# EasyEDA Pro project ProPrj_MSP_M0_G3507_扩展板_2025-09-12.epro, board PCB1_1
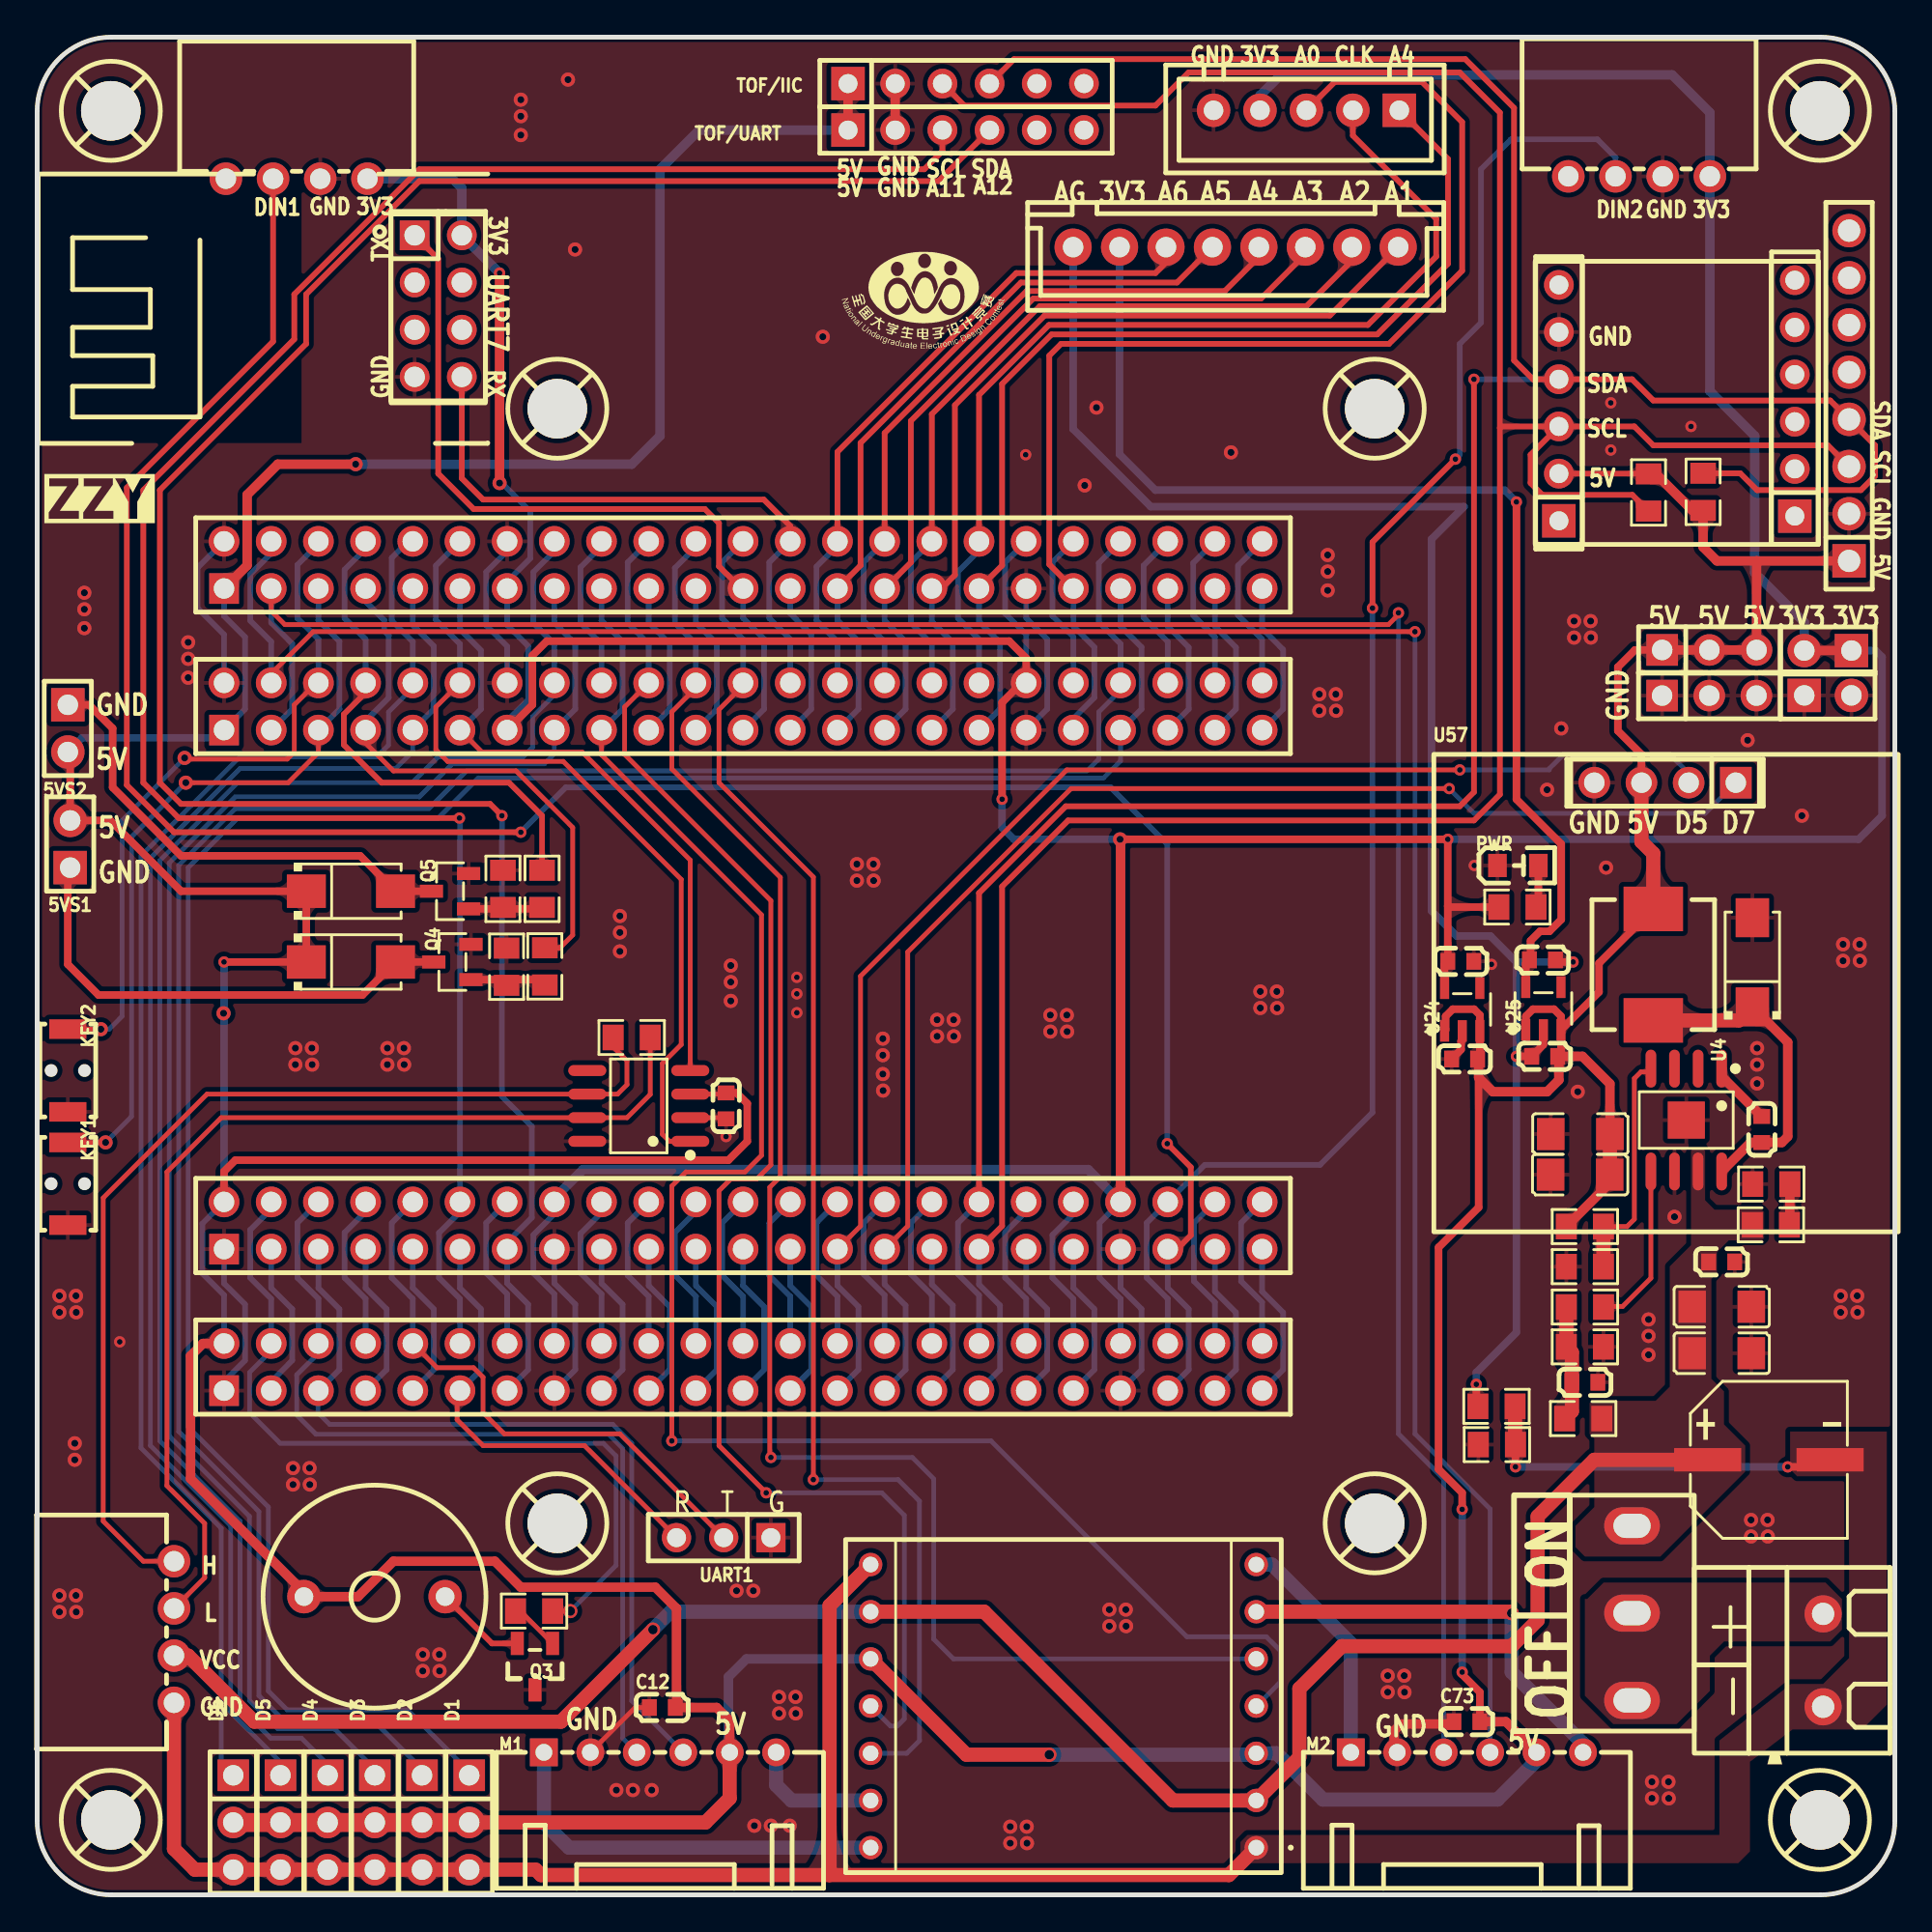
[diagram p2: board, top side]
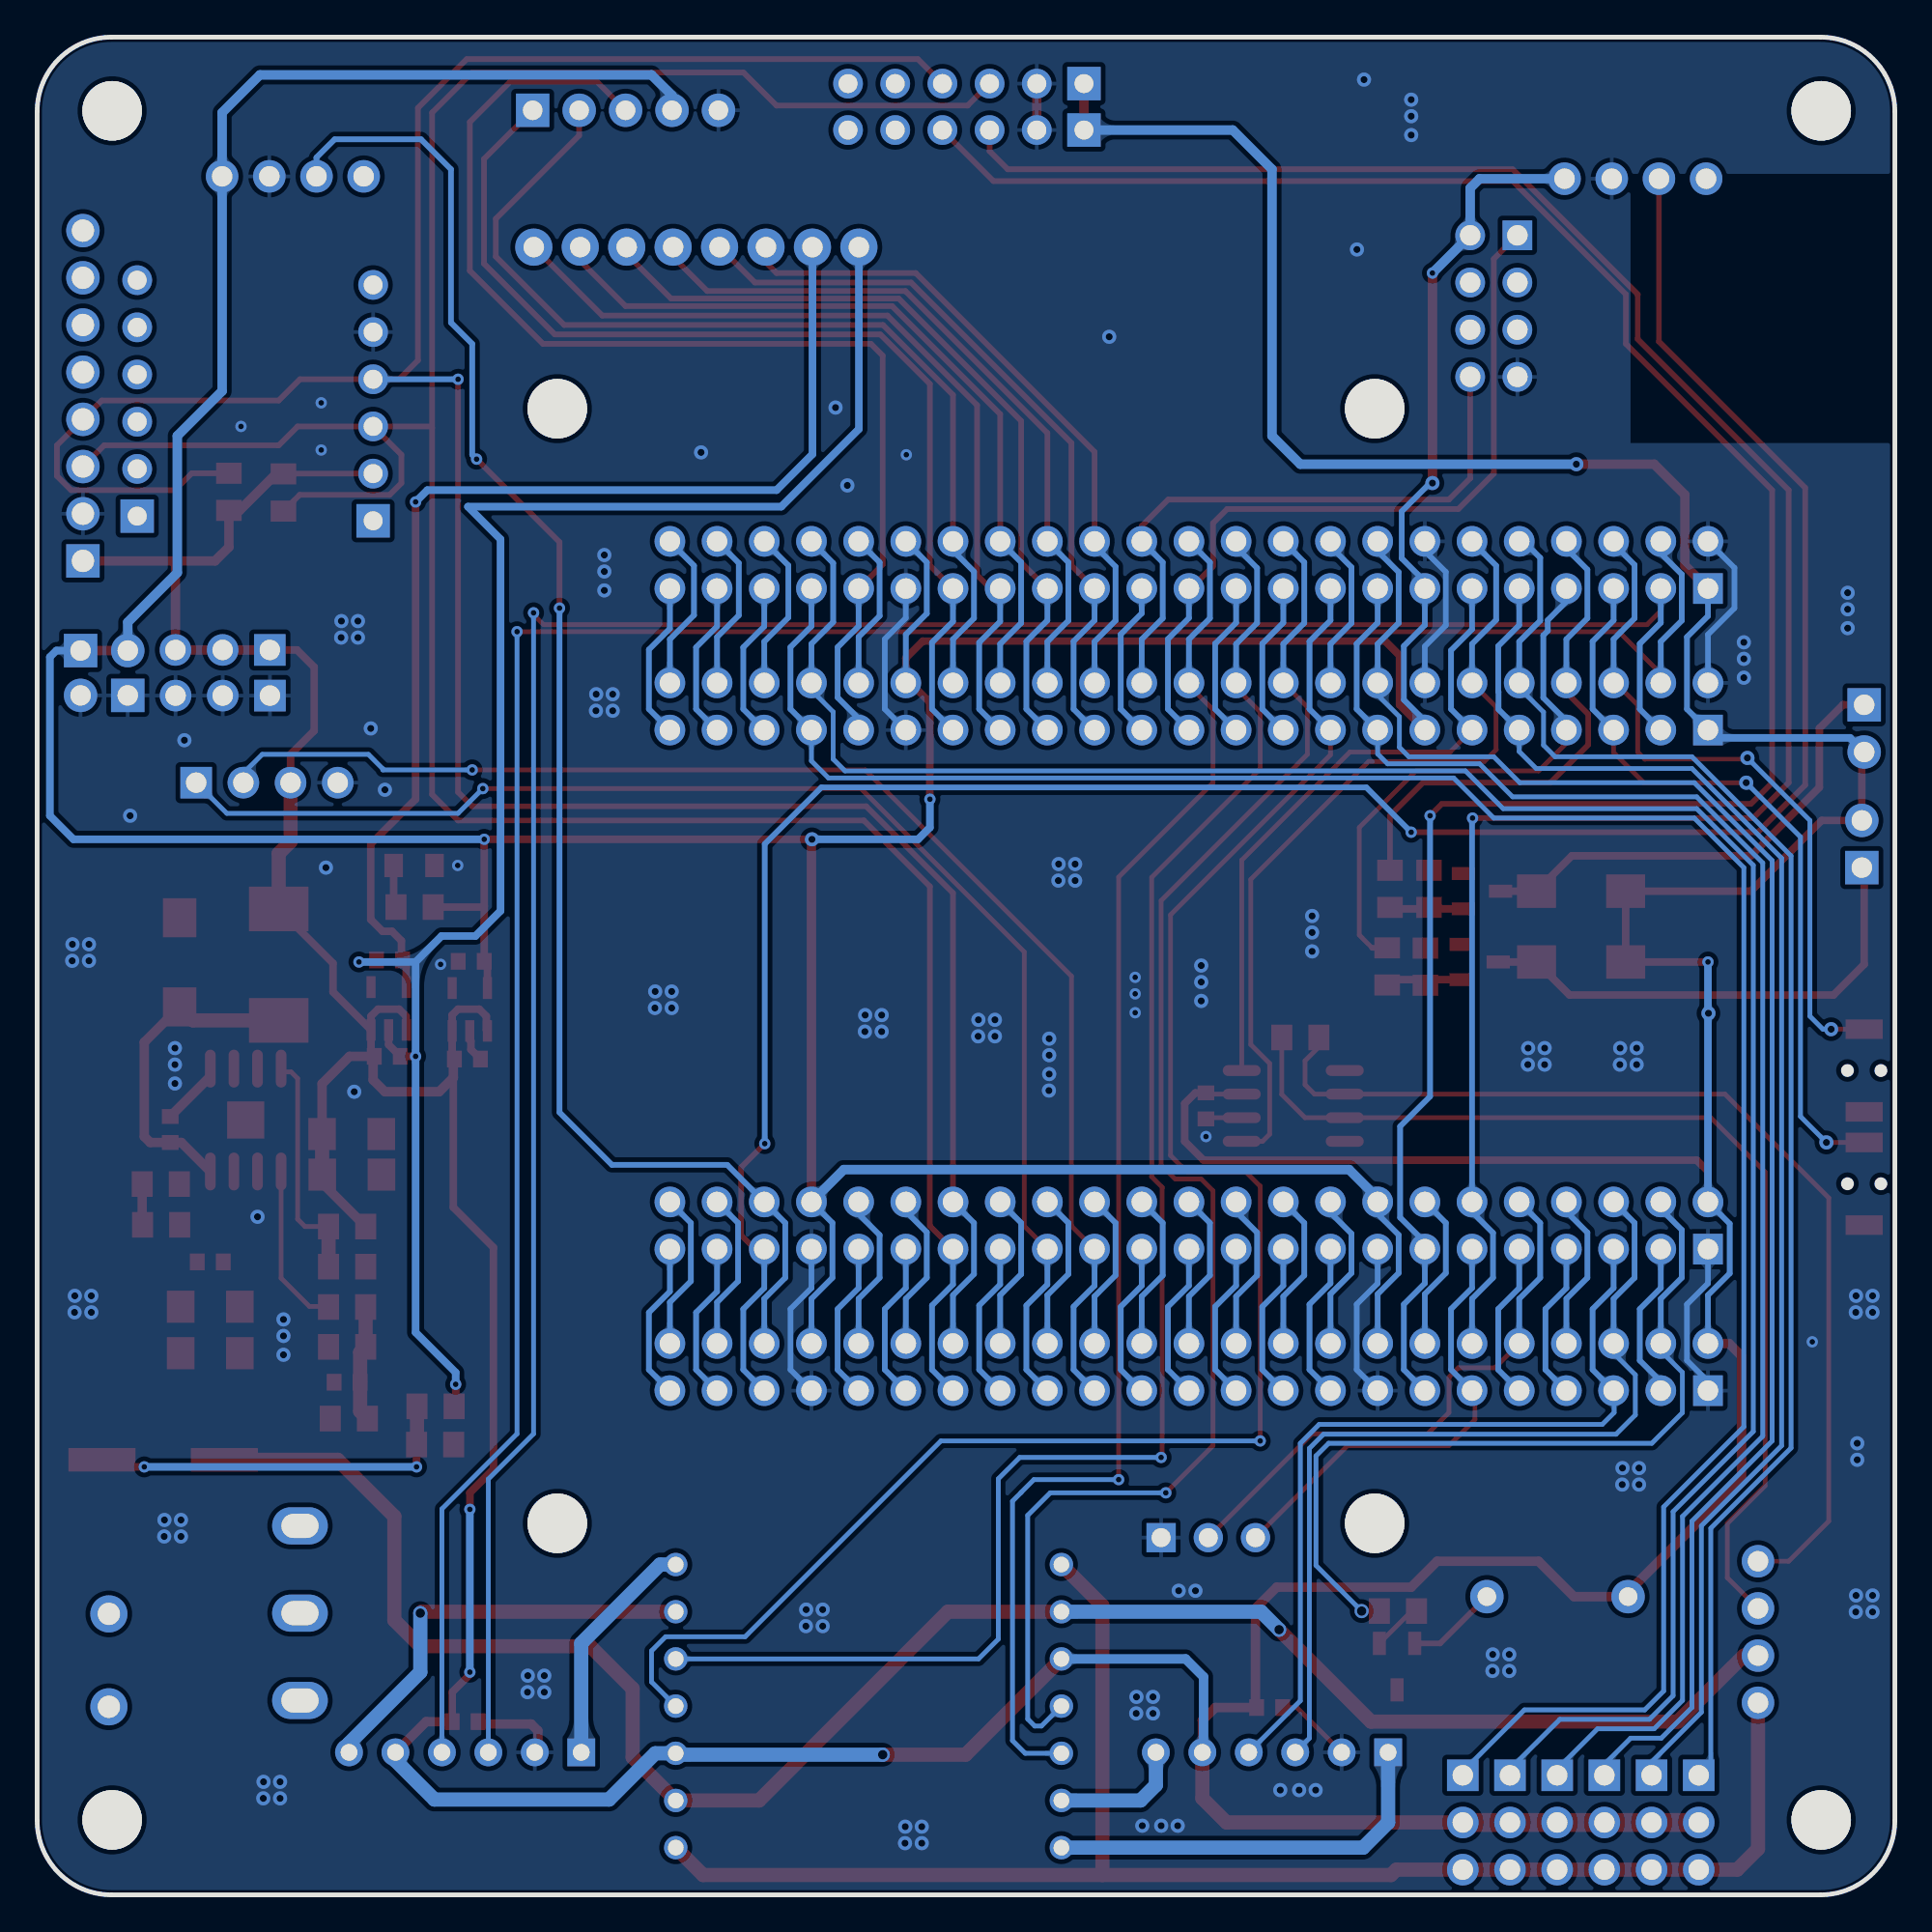
[diagram p3: board, bottom side, seen from below]

Outline 100 x 100 mm; copper layers: Top Layer, Bottom Layer. Coordinates in mm from the lower left corner of the outline.
Outline path: 0,96 0,4 arc(1.17,1.17) 4,0 96,0 arc(98.83,1.17) 100,4 100,96 arc(98.83,98.83) 96,100 4,100 arc(1.17,98.83) 0,96
Stack: Top Layer 0.035mm / Dielectric1 1.51mm FR4 er 4.5 / Bottom Layer 0.035mm

## Design rules (mm)
net CANL: DP1
net CANH: DP1
template: JLCPCB Capability(Two Layers Board)
spacing copperThickness1oz (default): track to track 0.102, other pairs 0.152 to 0.3
spacing copperThickness2oz: track to track 0.203, other pairs 0.152 to 0.3
track width copperThickness1oz (default): min 0.127, default 0.254, max 2.54
track width copperThickness2oz: min 0.203, default 0.254, max 2.54
differential pair differentialPair (default): width min 0.127, default 0.254, max 2.54; gap min 0.152, default 0.152
via viaSize (default): diameter min 0.5, default 0.61, max 10; hole min 0.3, default 0.305, max 6.3

## Placement (name value [footprint] x y rotation side)
5VS1  -  [HDR-TH_2P-P2.54-V-M-1]  1.78 56.57 90 top
5VS2  -  [HDR-TH_2P-P2.54-V-M-1]  1.65 62.79 270 top
BUZZER1  2.4kHz  [BUZ-TH_BD12.0-P7.60-D0.6-FD]  18.16 16.05 0 top
C3  220uF  [CAP-SMD_BD8.0-L8.3-W8.3-LS9.1-FD]  93.22 23.42 0 top
C4  4.7uF  [C0603]  90.68 34.07 0 top
C5  22uF  [C1206]  90.68 31.66 0 top
C6  47uF  [C1206]  90.68 29.16 0 top
C7  47uF  [C1206]  83.06 38.77 0 top
C8  22uF  [C1206]  83.07 40.95 0 top
C9  10nF  [C0603]  92.84 41.2 270 top
C12  100nF  [C0603]  33.66 10.08 0 top
C13  100NF  [C0603]  37.08 42.47 270 top
C32  100nF  [C0603]  83.31 27.59 180 top
C36  1uF  [C0603]  76.84 44.99 0 top
C37  1uF  [C0603]  76.63 50.25 180 top
C49  1uF  [C0603]  81.15 45.14 0 top
C50  1uF  [C0603]  81.03 50.33 180 top
C73  100nF  [C0603]  76.96 9.32 0 top
CN3  HWXJ  [CONN-TH_8P-P2.50-XH2.54-8P]  64.52 88.7 0 top
CN6  CAN  [CONN-TH_XH-4AW]  7.37 14.15 270 top
CN7  CCD  [CONN-TH_5P-P2.50_XH-5A]  68.33 96.06 180 top
CN9  L_DIN  [CONN-TH_XH-4AW]  13.97 92.38 180 top
CN10  R_DIN  [CONN-TH_XH-4AW]  86.23 92.51 180 top
D1  PZ254V-11-03P  [HDR-TH_3P-P2.54-V-M]  23.26 3.9 270 top
D2  PZ254V-11-03P  [HDR-TH_3P-P2.54-V-M]  20.72 3.9 270 top
D3  PZ254V-11-03P  [HDR-TH_3P-P2.54-V-M]  18.18 3.9 270 top
D4  PZ254V-11-03P  [HDR-TH_3P-P2.54-V-M]  15.64 3.9 270 top
D5  PZ254V-11-03P  [HDR-TH_3P-P2.54-V-M]  13.1 3.9 270 top
D6  PZ254V-11-03P  [HDR-TH_3P-P2.54-V-M]  10.56 3.9 270 top
ESP01S1  -  [HDR-TH_8P-P2.54-V-F-R2-C4-S2.54-1]  21.59 85.52 270 top
H6  -  [HDR-TH_6P-P2.54-V-F]  94.62 80.57 90 top
H20  -  [HDR-TH_8P-P2.54-V-F-1]  97.54 80.7 90 top
H21  -  [HDR-TH_3P-P2.54-V-M]  90.01 67.01 0 top
H22  -  [HDR-TH_2P-P2.54-V-M-1]  96.39 66.98 180 top
H24  -  [HDR-TH_2P-P2.54-V-M-1]  96.39 64.57 0 top
H25  -  [HDR-TH_3P-P2.54-V-M]  90.01 64.56 0 top
H26  -  [HDR-TH_4P-P2.54-V-F]  87.63 59.87 180 top
JY901I2C1  -  [HDR-TH_6P-P2.54-V-F]  81.91 80.31 90 top
KEY1  ZX-QC34-2TPDZ  [KEY-SMD_L3.9-W3.0-LS5.0-EH]  1.65 38.28 270 top
KEY2  ZX-QC34-2TPDZ  [KEY-SMD_L3.9-W3.0-LS5.0-EH]  1.65 44.37 270 top
M1  ZX-HA2.54-6PWZ  [CONN-TH_6P-P2.50_ZX-HA2.54-6PWZ-Y]  33.53 7.67 0 top
M2  ZX-HA2.54-6PWZ  [CONN-TH_6P-P2.50_ZX-HA2.54-6PWZ-Y]  76.96 7.67 0 top
P1  KF301-2P接线端子  [CONN-TH_XY301V-A-5.0-2P]  96.14 12.62 270 top
PWR  -  [LED_0805]  79.76 55.41 0 top
Q3  -  [S8550P_SOT]  26.8 12.24 90 top
Q4  AO3400A  [SOT-23-3_L2.9-W1.3-P1.90-LS2.4-BR]  22.35 50.22 0 top
Q5  AO3400A  [SOT-23-3_L2.9-W1.3-P1.90-LS2.4-BR]  22.22 54.03 0 top
R1  10K  [R0805]  93.33 36.07 0 top
R5  1K  [R0805]  93.35 38.26 0 top
R6  10K  [R0805]  83.31 35.97 180 top
R7  3.3K  [R0805]  83.31 33.82 0 top
R8  120R  [R0805]  32 46.15 0 top
R16  6.8KNTC  [R0805]  83.31 29.5 180 top
R17  10K  [R0805]  83.22 25.64 0 top
R18  0R  [R0805]  83.32 31.64 0 top
R19  0R  [R0805]  78.58 24.24 0 top
R20  3.3K  [R0805]  86.74 75.49 90 top
R21  3.3K  [R0805]  89.68 75.52 270 top
R23  1K  [R0805]  26.75 15.28 180 top
R24  6.8K  [R0805]  79.68 53.17 180 top
R89  0R  [R0805]  78.56 26.3 0 top
R90  22R  [R0805]  27.33 49.98 90 top
R91  10K  [R0805]  25.27 49.96 90 top
R92  22R  [R0805]  27.18 54.15 90 top
R93  10K  [R0805]  25.07 54.15 90 top
SCREW1  -  [M3螺丝]  3.97 4.03 270 top
SCREW2  -  [M3螺丝]  95.97 96.03 270 top
SCREW3  -  [M3螺丝]  3.97 96.03 270 top
SCREW4  -  [M3螺丝]  95.97 4.03 270 top
SCREW5  -  [M3螺丝]  72 20 0 top
SCREW6  -  [M3螺丝]  72 80 0 top
SCREW7  -  [M3螺丝]  28 80 0 top
SCREW8  -  [M3螺丝]  28 20 0 top
SW1  SS-12D10L5  [SW-TH_SS-12D10L5]  85.85 15.16 90 top
TOF/IIC  -  [HDR-TH_6P-P2.54-V-F]  50 97.5 0 top
TOF/UART  -  [HDR-TH_6P-P2.54-V-F]  50 95 0 top
U4  RT8289GSP  [SOIC-8_L5.0-W4.0-P1.27-LS6.0-BL-EP2.0]  88.77 41.71 180 top
U5  TJA1050T  [SOIC-8_L4.9-W3.9-P1.27-LS6.0-BL]  32.38 42.47 90 top
U24  RT9013-33GB  [SOT-23-5_L3.0-W1.7-P0.95-LS2.8-BL]  76.71 47.66 0 top
U25  RT9013-33GB  [SOT-23-5_L3.0-W1.7-P0.95-LS2.8-BL]  81.08 47.71 0 top
U41  AT8236  [AT8236-Dual-Module]  55.25 10.21 180 top
U48  -  [jy901]  95.88 72.57 180 top
U50  -  [esp01s]  24.26 92.63 270 top
U51  10uH  [IND-SMD_L7.0-W6.6]  87 50.07 270 top
U52  SS54  [SMA_L4.2-W2.6-LS5.1-RD]  16.89 50.22 0 top
U53  SS54  [SMA_L4.2-W2.6-LS5.1-RD]  92.33 50.2 90 top
U54  SS54  [SMA_L4.2-W2.6-LS5.1-RD]  16.89 54.03 0 top
U55  HC-PM254-8.5H-2x23PZ  [HDR-TH_46P-P2.54-V-F-R2-C23-S2.54]  38 36.03 0 top
U56  HC-PM254-8.5H-2x23PZ  [HDR-TH_46P-P2.54-V-F-R2-C23-S2.54]  38 63.97 0 top
U57  -  [OLED_9.6]  75.18 61.39 0 top
U58  HC-PM254-8.5H-2x23PZ  [HDR-TH_46P-P2.54-V-F-R2-C23-S2.54]  38 28.41 0 top
U59  HC-PM254-8.5H-2x23PZ  [HDR-TH_46P-P2.54-V-F-R2-C23-S2.54]  38 71.59 0 top
UART1  -  [HDR-TH_3P-P2.54-V-F]  36.96 19.23 180 top

## Footprints (pads in the part's own frame, mm; a bottom-side part is the same pattern mirrored in y, then rotated)
AT8236-Dual-Module
  round 1.26 hole 0.84: 1(-10.38,7.671) 2(-10.38,5.131) 3(-10.38,2.591) 4(-10.38,0.051) 5(-10.38,-2.489) 6(-10.38,-5.029) 7(-10.38,-7.569) 8(10.38,7.671) 9(10.38,5.131) 10(10.38,2.591) 11(10.38,0.051) 12(10.38,-2.489) 13(10.38,-5.029) 14(10.38,-7.569)
BUZ-TH_BD12.0-P7.60-D0.6-FD
  round 1.8 hole 1: 1(-3.8,0) 2(3.8,0)
C0603
  rect 0.8x0.9 smd: 1(-0.7,0) 2(0.7,0)
C1206
  rect 1.485x1.728 smd: 1(-1.593,0) 2(1.593,0)
CAP-SMD_BD8.0-L8.3-W8.3-LS9.1-FD
  rect 3.61x1.26 smd: 1(-3.295,0) 2(3.295,0)
CONN-TH_5P-P2.50_XH-5A
  rect 1.8x1.8 hole 1.05: 1(-5,0)
  round 1.8 hole 1.05: 2(-2.498,0) 3(0.002,0) 4(2.501,0) 5(5,0)
CONN-TH_6P-P2.50_ZX-HA2.54-6PWZ-Y
  rect 1.5x1.5 hole 0.9: 1(-6.25,0)
  round 1.5 hole 0.9: 2(-3.75,0) 3(-1.25,0) 4(1.25,0) 5(3.75,0) 6(6.25,0)
CONN-TH_8P-P2.50-XH2.54-8P
  round 2 hole 1.1: 1(8.75,0) 2(6.25,0) 3(3.75,0) 4(1.25,0) 5(-1.25,0) 6(-3.75,0) 7(-6.25,0) 8(-8.75,0)
CONN-TH_XH-4AW
  round 1.75 hole 1.1: 1(-3.81,0) 2(-1.27,0) 3(1.27,0) 4(3.81,0)
CONN-TH_XY301V-A-5.0-2P
  round 2 hole 1.2: 1(-2.5,0) 2(2.5,0)
HDR-TH_2P-P2.54-V-M-1
  rect 1.8x1.8 hole 1.1: 1(-1.27,0)
  round 1.8 hole 1.1: 2(1.27,0)
HDR-TH_3P-P2.54-V-F
  rect 1.575x1.575 hole 1.02: 1(-2.54,0)
  round 1.575 hole 1.02: 2(0,0) 3(2.54,0)
HDR-TH_3P-P2.54-V-M
  rect 1.7x1.7 hole 1.1: 1(-2.54,0)
  round 1.7 hole 1.1: 2(0,0) 3(2.54,0)
HDR-TH_4P-P2.54-V-F
  rect 1.7x1.7 hole 1.1: 1(-3.81,0)
  round 1.7 hole 1.1: 2(-1.27,0) 3(1.27,0) 4(3.81,0)
HDR-TH_6P-P2.54-V-F
  rect 1.8x1.8 hole 1.02: 1(-6.35,0)
  round 1.6 hole 1.02: 2(-3.81,0) 3(-1.27,0) 4(1.27,0) 5(3.81,0) 6(6.35,0)
HDR-TH_8P-P2.54-V-F-1
  rect 1.8x1.8 hole 1.2: 1(-8.89,0)
  round 1.8 hole 1.2: 2(-6.35,0) 3(-3.81,0) 4(-1.27,0) 5(1.27,0) 6(3.81,0) 7(6.35,0) 8(8.89,0)
HDR-TH_8P-P2.54-V-F-R2-C4-S2.54-1
  rect 1.6x1.6 hole 1.1: 1(-3.81,-1.27)
  round 1.6 hole 1.1: 2(-3.81,1.27) 3(-1.27,-1.27) 4(-1.27,1.27) 5(1.27,-1.27) 6(1.27,1.27) 7(3.81,-1.27) 8(3.81,1.27)
HDR-TH_46P-P2.54-V-F-R2-C23-S2.54
  rect 1.6x1.65 hole 1.1: 1(-27.94,-1.27)
  round 1.65 hole 1.1: 2(-27.94,1.27) 3(-25.4,-1.27) 4(-25.4,1.27) 5(-22.86,-1.27) 6(-22.86,1.27) 7(-20.32,-1.27) 8(-20.32,1.27) 9(-17.78,-1.27) 10(-17.78,1.27) 11(-15.24,-1.27) 12(-15.24,1.27) 13(-12.7,-1.27) 14(-12.7,1.27) 15(-10.16,-1.27) 16(-10.16,1.27) 17(-7.62,-1.27) 18(-7.62,1.27) 19(-5.08,-1.27) 20(-5.08,1.27) 21(-2.54,-1.27) 22(-2.54,1.27) 23(0,-1.27) 24(0,1.27) 25(2.54,-1.27) 26(2.54,1.27) 27(5.08,-1.27) 28(5.08,1.27) 29(7.62,-1.27) 30(7.62,1.27) 31(10.16,-1.27) 32(10.16,1.27) 33(12.7,-1.27) 34(12.7,1.27) 35(15.24,-1.27) 36(15.24,1.27) 37(17.78,-1.27) 38(17.78,1.27) 39(20.32,-1.27) 40(20.32,1.27) 41(22.86,-1.27) 42(22.86,1.27) 43(25.4,-1.27) 44(25.4,1.27) 45(27.94,-1.27) 46(27.94,1.27)
IND-SMD_L7.0-W6.6
  rect 2.4x3.2 smd: 1(-3,0) 2(3,0)
KEY-SMD_L3.9-W3.0-LS5.0-EH
  rect 1.05x2 smd: 1(-2.225,0) 2(2.225,0)
LED_0805
  rect 1x1.25 smd: 1(-1.15,0.005) 2(1.05,0.005)
M3螺丝
  round 3.2 hole 3.2: 1(0,0)
R0805
  rect 1.133x1.377 smd: 1(-1,0) 2(1,0)
S8550P_SOT
  rect 1.25x0.701 smd: 1(1.292,-0.95) 2(1.292,0.95) 3(-1.208,0)
SMA_L4.2-W2.6-LS5.1-RD
  rect 2.1x1.8 smd: 1(-2.4,0) 2(2.4,0)
SOIC-8_L4.9-W3.9-P1.27-LS6.0-BL
  oval 0.588x2.045 smd: 1(-1.905,-2.772) 2(-0.635,-2.772) 3(0.635,-2.772) 4(1.905,-2.772) 5(1.905,2.772) 6(0.635,2.772) 7(-0.635,2.772) 8(-1.905,2.772)
SOIC-8_L5.0-W4.0-P1.27-LS6.0-BL-EP2.0
  oval 0.574x2.038 smd: 1(-1.905,-2.769) 2(-0.635,-2.769) 3(0.635,-2.769) 4(1.905,-2.769) 5(1.905,2.769) 6(0.635,2.769) 7(-0.635,2.769) 8(-1.905,2.769)
  rect 2x2 smd: 9(0,0)
SOT-23-3_L2.9-W1.3-P1.90-LS2.4-BR
  rect 1.25x0.7 smd: 1(1,-0.95) 2(1,0.95) 3(-1,0)
SOT-23-5_L3.0-W1.7-P0.95-LS2.8-BL
  rect 0.49x1.157 smd: 1(-0.95,-1.153) 2(0,-1.153) 3(0.95,-1.153)
  rect 0.49x1.175 smd: 4(0.95,1.153) 5(-0.95,1.153)
SW-TH_SS-12D10L5
  oval 2x3 hole 1.3x2: 1(-4.7,0) 2(0,0) 3(4.7,0)

## Nets
As in the schematic, except:
GND: C4.2 C5.2 C6.2 C7.1 C8.1 C12.1 C13.2 C32.1 C36.1 C37.1 C73.1 CN7.5 CN9.2 CN10.2 ESP01S1.7 H20.2 H24.1 H24.2 H25.1 H25.2 H25.3 H26.4 JY901I2C1.5 KEY1.2 KEY2.2 M1.2 M2.2 PWR.1 Q3.3 Q4.2 Q5.2 R5.1 R7.1 R16.1 R19.1 R91.2 R93.2 TOF/IIC.2 TOF/UART.2 U4.6 U4.9 U5.2 U5.8 U24.2 U53.2 U55.1 U55.15 U55.39 U56.2 U56.14 U56.35 U58.1 U58.15 U58.39 U59.2 U59.14 U59.35 UART1.1
PA9: U55.10 U58.10 UART1.2
PA10: U55.11 U58.11 UART1.3

Pads without a net: CN9 4; CN10 4; ESP01S1 3 4 5 6; H6 1 2 3 4 5 6; H20 5 6 7 8; JY901I2C1 1 6; SCREW1 1; SCREW2 1; SCREW3 1; SCREW4 1; SCREW5 1; SCREW6 1; SCREW7 1; SCREW8 1; TOF/IIC 5 6; TOF/UART 5 6; U4 2 3; U5 5; U24 4; U25 4

## Via types
v1: diameter 0.762, hole 0.381, Top Layer to Bottom Layer, 139 vias
v2: diameter 0.61, hole 0.305, Top Layer to Bottom Layer, 38 vias
v3: diameter 0.762, hole 0.508, Top Layer to Bottom Layer, 4 vias

## Routing (per net, layer and track width the routed paths; a pad name or vN(x,y) marks a point on that pad's centre or on a via; arc(x,y) is an arc through that point)
3V3: length 286
  Top Layer w0.406: v2(51.94,58.98) 51.94,64.19 53,65.24 U56.36 53.24,66.57 52.32,67.49 27.43,67.49 26.66,66.72 26.66,64.06 U56.13 ; 75.94,53.22 C37.2 75.76,50.08 75.76,48.81 ; 75.94,53.22 v2(75.94,56.82) 58.25,56.82 ; 75.94,53.22 75.99,53.17 R24.2
  Top Layer w0.508: v2(24.89,87.3) v1(24.89,76) ; U55.40 58.32,56.75 58.25,56.82 ; H22.2 H22.1
  Bottom Layer w0.305: U59.36 52.11,71.73 52.11,68.97 53.24,67.84 53.24,64.95 ; U55.40 57.19,36.17 57.19,33.22 58.32,32.09 U58.40 ; U56.13 25.3,63.2 26.43,64.33 26.43,67.22 25.3,68.35 U59.13 25.3,70.7 26.54,71.94 26.54,74.47 25.02,76 v1(24.89,76) ; U58.16 27.84,32.34 26.71,33.47 26.71,35.52 27.84,36.65 U55.16
  Bottom Layer w0.406: v2(51.94,58.98) 51.94,57.45 52.58,56.82 v1(58.29,56.82) ; H22.1 98.97,66.98 99.31,66.63 99.31,58.09 98.04,56.82 v2(75.94,56.82)
  Bottom Layer w0.508: H22.2 95.12,68.5 92.46,71.17 92.46,78.54 90.04,80.95 CN10.1 90.04,95.94 88.01,97.97 66.93,97.97 65.83,96.86 CN7.4 ; U55.40 56.58,39.04 29.38,39.04 27.84,37.5 U55.16 ; v2(24.89,87.3) ESP01S1.2 22.86,91.87 22.35,92.38 CN9.1
5V_SW1: length 30
  Top Layer w0.254: U56.7 17.68,62 19.18,60.5 25.78,60.5 28.83,57.45 28.83,51.67 28.14,50.98
  Top Layer w0.305: R90.2 28.14,50.98
  Bottom Layer w0.305: U56.7 17.68,63.2 18.92,64.44 18.92,67.8 18.68,68.04 18.68,68.62 17.68,69.62 U59.7
5V_SW2: length 27.9
  Top Layer w0.305: R92.2 27.18,58.09 25.4,59.87 18.55,59.87 16.51,61.91 16.51,63.55 17.68,64.72 U56.8
  Bottom Layer w0.305: U59.8 17.68,72.47 16.55,71.34 16.55,68.72 17.68,67.59 17.68,64.95
+5V: length 413.9
  Top Layer w0.254: C13.1 37.02,43.1 U5.3
  Top Layer w0.305: R20.2 86.72,76.5 JY901I2C1.2
  Top Layer w0.406: 77.6,43.99 77.6,37.01 75.44,34.85 75.44,22.91 76.71,21.64 v2(76.71,20.75) ; C36.2 77.66,45.12 U24.3 77.66,47.36 77.35,47.68 76.2,47.68 75.82,47.3 75.82,46.56 U24.1 ; U25.1 80.14,46.56 80.14,47.3 80.52,47.68 81.65,47.68 82.03,47.3 U25.3 ; U25.3 82.03,45.31 C49.2 ; U25.3 84.07,48.6 84.07,50.15 U51.1 ; 5VS2.2 1.78,61.39 5VS1.2 3.94,57.84 7.75,54.03 U54.1 14.49,54.02 U52.1 v2(10.06,50.22) ; v2(76.71,11.99) 76.71,11.86 77.66,10.91 C73.2 ; C13.1 37.65,43.17 38.23,42.6 38.23,40.56 37.21,39.55 10.67,39.55 10.06,38.94 U55.2 ; H26.3 86.36,61.39 85.09,62.66 85.09,66.09 86.01,67.01 H21.1
  Top Layer w0.508: TOF/IIC.1 TOF/UART.1 ; R6.2 84.65,38.31 C7.2 ; 92.56,71.81 90.42,71.81 89.68,72.55 R21.2 89.1,74.52 87.14,76.49 R20.2 ; 92.56,71.81 92.56,67.01 H21.2 H21.1 ; 92.56,71.81 H20.1 ; M1.5 37.28,9.38 36.58,10.08 C12.2 34.42,10.15 34.42,15.42 33.27,16.56 26.03,16.56 24.64,17.96 19.18,17.96 17.27,16.05 BUZZER1.1 14.36,16.3 8.25,22.4 8.25,29.01 8.93,29.68 U58.2 ; C73.2 79.06,9.32 M2.5 ; C36.2 77.6,44.93 77.6,43.99 78.36,43.23 81.28,43.23 81.91,43.87 81.91,45.07 C49.2 83.19,45.14 84.66,43.66 C8.2 ; v1(17.14,77.01) 12.95,77.01 11.3,75.36 11.3,71.56 U59.1
  Top Layer w0.762: U41.12 50.02,7.54 v3(54.48,7.54) ; C8.2 84.66,38.78 C7.2 ; M1.5 37.28,5.2 35.98,3.9 D1.2 ; U51.1 87,56.06 86.36,56.69 H26.3
  Top Layer w1.016: D6.2 D5.2 D4.2 D3.2 D2.2 D1.2
  Bottom Layer w0.305: U58.2 10.06,32.28 8.89,33.45 8.89,36.13 U55.2 ; U56.1 11.19,63.83 11.19,67.71 10.06,68.84 U59.1
  Bottom Layer w0.406: v2(76.71,11.99) v2(76.71,20.75) ; U55.2 10.06,47.39 ; 10.06,47.39 v2(10.06,50.22) ; 10.06,47.39 10.03,47.42 v1(10.03,47.46) ; U56.1 9.64,62.28 2.41,62.28 5VS2.2
  Bottom Layer w0.508: v1(17.14,77.01) 32,77.01 33.53,78.54 33.53,92.89 35.64,95 TOF/UART.1 ; M1.5 37.21,7.74 37.21,11.74 38.18,12.7 U41.12
  Bottom Layer w0.762: v3(54.48,7.54) 65.55,7.54 U41.3 66.73,7.62 69.22,5.13 78.61,5.13 80.71,7.23 M2.5
A3V3: length 61.8
  Top Layer w0.406: U25.5 80.14,48.87 80.14,50.13 C50.2 80.39,50.39 80.39,51.36 80.9,51.87 81.41,51.87 82.04,52.5 82.04,56.57 79.63,58.98 v2(79.63,74.98)
  Bottom Layer w0.406: v2(79.63,74.98) 78.99,75.62 60.2,75.62 58.27,77.55 CN3.7
AGND: length 92.2
  Top Layer w0.406: v2(82.68,50.22) 81.84,50.22 C50.1 ; v2(79.63,45.14) C49.1 81.08,45.76 U25.2 ; v2(77.47,27.48) 77.47,26.38 R89.1
  Bottom Layer w0.406: 79.63,50.22 v2(82.68,50.22) ; 79.63,50.22 78.23,51.61 76.41,51.61 75.06,52.97 75.06,72.97 76.81,74.73 59.94,74.73 55.77,78.91 CN3.8 ; 79.63,50.22 v2(79.63,45.14) 79.63,30.28 77.47,28.12 v2(77.47,27.48)
GND: length 67.2
  Top Layer w0.254: C12.1 32.19,10.08 M1.2 ; C13.2 37.02,41.83 U5.2
  Top Layer w0.406: U24.2 76.71,46.02 76.65,45.96 76.65,45.5 C36.1
  Top Layer w0.508: C73.1 76.13,9.19 73.41,9.19 73.05,8.84 73.05,7.84 M2.2 ; TOF/IIC.2 TOF/UART.2
  Bottom Layer w0.305: U59.35 53.24,68.73 54.37,67.6 54.37,63.83 U56.35 ; U55.15 27.84,32.92 28.97,31.79 28.97,28.27 U58.15 ; U58.39 59.45,28.27 59.45,31.53 58.32,32.66 U55.39 ; U59.14 25.3,72.34 24.17,71.21 24.17,68.34 25.3,67.21 25.3,64.95 ; 10.06,64.95 10.06,67.84 8.64,69.27 8.64,71.44 U59.2 ; U58.1 10.06,27.64 11.19,28.77 11.19,31.79 10.06,32.92 U55.1
  vias: v1(1.2,32.25) v1(1.2,31.36) v1(1.2,16.12) v1(1.2,15.23) v1(2.03,24.31) v1(2.03,23.42) v1(2.09,32.25) v1(2.1,31.36) v1(2.09,16.12) v1(2.1,15.23) v1(2.54,70.09) v1(2.54,69.2) v1(2.54,68.19) v1(8.13,67.42) v1(8.13,66.54) v1(8.13,65.52) v1(13.77,22.97) v1(13.77,22.09) v1(13.9,45.58) v1(13.9,44.69) v1(14.66,22.97) v1(14.68,22.09) v1(14.79,45.58) v1(14.8,44.69) v1(18.85,45.58) v1(18.85,44.69) v1(19.74,45.58) v1(19.76,44.69) v1(20.76,12.94) v1(20.76,12.05) v1(21.65,12.94) v1(21.66,12.05) v1(26.03,96.63) v1(26.03,95.75) v1(26.03,94.73) v1(28.57,97.71) v1(28.96,88.57) v1(31.18,5.64) v1(31.37,52.69) v1(31.37,51.8) v1(31.37,50.79) v1(32.07,5.64) v1(33.08,5.64) v1(37.34,50.03) v1(37.34,49.14) v1(37.34,48.12) v1(37.65,16.37) v1(38.55,16.37) v1(38.61,3.72) v1(39.49,3.72) v1(39.93,10.66) v1(39.93,9.77) v1(40.51,3.72) v1(40.82,10.66) v1(40.84,9.77) v1(42.29,83.87) v1(44.13,55.49) v1(44.13,54.6) v1(45.01,55.49) v1(45.03,54.6) v1(45.52,46.09) v1(45.52,45.2) v1(45.52,44.18) v1(45.54,43.29) v1(48.44,47.1) v1(48.44,46.22) v1(49.33,47.1) v1(49.35,46.22) v1(52.38,3.67) v1(52.38,2.78) v1(53.27,3.67) v1(53.28,2.78) v1(54.54,47.36) v1(54.54,46.47) v1(55.43,47.36) v1(55.44,46.47) v1(56.39,75.87) v1(57.02,80.06) v1(57.71,15.35) v1(57.71,14.47) v1(58.6,15.35) v1(58.62,14.47) v1(64.26,77.65) v1(65.84,48.63) v1(65.84,47.74) v1(66.73,48.63) v1(66.75,47.74) v1(69.02,64.63) v1(69.02,63.74) v1(69.47,72.12) v1(69.47,71.23) v1(69.47,70.22) v1(69.91,64.63) v1(69.92,63.74) v1(72.7,11.8) v1(72.7,10.91) v1(73.59,11.8) v1(73.6,10.91) v1(81.28,59.49) v1(82.04,62.79) v1(82.73,68.57) v1(82.73,67.68) v1(82.93,43.23) v1(83.62,68.57) v1(83.64,67.68) v1(84.46,55.3) v1(86.74,30.98) v1(86.74,30.09) v1(86.74,29.07) v1(86.92,6.08) v1(86.92,5.19) v1(87.81,6.08) v1(87.83,5.19) v1(88.14,36.5) v1(92.07,62.15) v1(92.26,20.18) v1(92.26,19.29) v1(92.58,45.58) v1(92.58,44.69) v1(92.58,43.68) v1(93.15,20.18) v1(93.16,19.29) v1(95,58.09) v1(97.08,32.25) v1(97.08,31.36) v1(97.21,51.17) v1(97.21,50.28) v1(97.97,32.25) v1(97.99,31.36) v1(98.1,51.17) v1(98.11,50.28) v2(4.44,29.77) v2(37.08,40.82) v2(40.89,49.39) v2(40.89,48.5) v2(40.89,47.49) v2(53.21,77.52) v2(77.36,55.41) v2(78.28,50.09) v2(84.71,80.31) v2(84.71,77.78) v2(89.03,79.05)
PGND: length 105.3
  Top Layer w0.406: v2(94.23,23.04) 96.13,23.04 C3.2 ; R19.2 v2(79.58,23.04)
  Top Layer w0.762: 42.66,1.07 27.12,1.07 26.83,1.36 D1.3 D2.3 D3.3 D4.3 D5.3 D6.3 8.48,1.36 7.37,2.47 CN6.4 ; 42.66,1.07 42.66,15.57 U41.14 ; 42.66,1.07 64.15,1.07 U41.1 ; R19.2 79.56,24.26 R89.2
  Bottom Layer w0.406: v2(79.58,23.04) v2(94.23,23.04)
VCC: length 103.7
  Top Layer w0.762: U41.13 50.98,15.24 61.14,5.08 U41.2 67.94,7.4 67.94,11.1 70.23,13.39 79.38,13.39 80.77,14.78 80.77,20.37 83.82,23.42 C3.1 ; v3(33.15,14.28) 28.19,9.32 11.68,9.32 8.13,12.88 CN6.3
  Bottom Layer w0.762: v3(33.15,14.28) 34.11,15.24 U41.13
VDDA: length 9
  Bottom Layer w0.305: U59.42 59.56,71.56 59.56,68.76 60.86,67.46 60.86,64.95
ADC1: length 46.6
  Top Layer w0.305: U59.31 48.68,70.32 49.4,71.04 49.4,80.19 54.23,85.01 69.58,85.01 CN3.1
  Bottom Layer w0.305: U59.31 48.16,68.54 49.29,67.42 49.29,63.83 U56.31
ADC2: length 42.5
  Top Layer w0.305: U59.32 48.16,79.71 53.97,85.52 68.33,85.52 70.77,87.96 CN3.2
  Bottom Layer w0.305: 48.16,64.95 48.16,67.33 47.03,68.46 47.03,71.73 U59.32
ADC3: length 43.5
  Top Layer w0.305: CN3.3 68.27,88.32 65.88,85.93 53.62,85.93 47.03,79.34 47.03,71.72 45.63,70.32 U59.29
  Bottom Layer w0.305: U59.29 45.62,68.6 46.75,67.47 46.75,63.83 U56.29
ADC4: length 39.3
  Top Layer w0.305: CN3.4 65.77,88.17 63.93,86.34 53.26,86.34 45.62,78.69 U59.30
  Bottom Layer w0.305: U59.30 44.49,71.73 44.49,68.59 45.62,67.46 45.62,64.95
ADC5: length 40.2
  Top Layer w0.305: CN3.5 61.36,86.79 52.96,86.79 44.32,78.16 44.32,71.56 U59.27
  Bottom Layer w0.305: U59.27 43.08,68.6 44.21,67.47 44.21,63.83 U56.27
ADC6: length 36.4
  Top Layer w0.305: U59.28 43.08,77.67 52.71,87.3 60.2,87.3 60.77,87.87 CN3.6
  Bottom Layer w0.305: U59.28 43.08,72.63 41.95,71.5 41.95,68.59 43.08,67.46 43.08,64.95
ADC_VIN: length 2.2
  Top Layer w0.508: R5.2 94.35,36.09 R1.2
AO: length 63.7
  Top Layer w0.305: U59.37 54.48,71.62 54.48,82.86 55.12,83.49 72.77,83.49 76.71,87.43 76.71,95.43 74.55,97.59 69.85,97.59 CN7.3
  Bottom Layer w0.305: U59.37 55.78,68.29 56.91,67.16 56.91,64.45 55.78,63.32 U56.37
AO1: length 7.2
  Bottom Layer w0.762: U41.9 40.6,5.08 39.78,5.91 M1.6
AO2: length 21.9
  Bottom Layer w0.762: U41.8 28.63,2.54 27.28,3.89 M1.1
BO1: length 22.9
  Top Layer w0.762: U41.6 79.3,15.24 v3(79.38,15.16)
  Bottom Layer w0.762: v3(79.38,15.16) 79.38,11.99 83.21,8.15 M2.6
BO2: length 12.7
  Bottom Layer w0.762: M2.1 70.71,13.54 66.47,17.78 U41.7
BUZZER: length 43.8
  Top Layer w0.254: R23.1 v3(28.7,15.28)
  Bottom Layer w0.254: v3(28.7,15.28) 31.16,17.73 31.16,23.63 30.48,24.31 13.08,24.31 11.44,25.95 11.44,28.12 12.6,29.29 U58.4
  Bottom Layer w0.305: U58.4 12.6,32.09 11.47,33.22 11.47,35.8 12.6,36.93 U55.4
CAN_RX: length 35.2
  Top Layer w0.254: U5.4 35.16,55.7 29.34,61.52 23.94,61.52 U56.11
  Bottom Layer w0.305: U59.11 22.76,68.12 23.89,66.99 23.89,63.83 U56.11
CAN_TX: length 45
  Top Layer w0.254: U56.12 21.46,63.94 21.46,61.65 22.1,61.01 28.32,61.01 34.67,54.66 34.67,45.77 33.66,44.75 33.66,40.94 34.04,40.56 U5.1
  Bottom Layer w0.305: 22.76,64.95 22.76,67.33 21.46,68.63 21.46,71.55 22.76,72.85 U59.12
CANH: length 55.8
  Top Layer w0.254: R8.2 33,43.09 31.75,41.83 U5.7 9.91,41.83 6.98,38.91 6.98,22.02 9.02,19.99 9.02,17.07 CN6.2
CANL: length 55.7
  Top Layer w0.254: CN6.1 5.72,17.96 3.56,20.12 3.56,37.52 9.14,43.1 U5.6 31.24,43.1 31.75,43.61 31.75,44.9 31,45.64 R8.1
CCD_CLK: length 54.2
  Top Layer w0.305: U59.34 50.7,80.74 54.47,84.51 71.63,84.51 75.31,88.19 75.31,90.22 70.82,94.71 CN7.2
  Bottom Layer w0.305: 50.7,64.95 50.7,67.59 49.57,68.72 49.57,71.23 50.7,72.36 U59.34
DIN1: length 126.9
  Top Layer w0.305: v2(26.03,57.2) 7.37,57.2 4.83,59.74 4.83,75.74 12.7,83.62 CN9.3 ; U55.41 61.36,34.76 62.1,35.5 62.1,39.17 v2(60.83,40.44)
  Bottom Layer w0.305: U58.41 61.99,28.27 61.99,31.53 60.86,32.66 U55.41 ; v2(26.03,57.2) 28.45,59.61 57.78,59.61 60.83,56.57 v2(60.83,40.44)
DIN2: length 84.1
  Top Layer w0.305: v2(76.34,77.28) 71.88,72.82 v2(71.88,69.27)
  Bottom Layer w0.305: U58.42 60.86,32.09 59.73,33.22 59.73,36.17 U55.42 62.85,39.29 69.06,39.29 71.88,42.12 v2(71.88,69.27) ; CN10.3 84.96,93.52 83.99,94.5 79.34,94.5 77.72,92.89 77.72,84.63 76.58,83.49 76.58,77.52 v2(76.34,77.28)
E1A: length 45.1
  Bottom Layer w0.254: U58.5 15.11,27.11 15.11,25.96 15.75,25.32 30.99,25.32 32,24.31 32,10.44 M1.4
  Bottom Layer w0.305: U58.5 16.27,28.27 16.27,31.53 15.14,32.66 U55.5
E1B: length 47.9
  Bottom Layer w0.254: M1.3 31.52,8.43 31.52,24.03 30.75,24.8 15.01,24.8 13.97,25.83 13.97,27.99 15.14,29.16 U58.6
  Bottom Layer w0.305: U58.6 15.14,32.09 14.01,33.22 14.01,36.17 U55.6
E2A: length 133.8
  Top Layer w0.254: v2(74.17,68) 14.86,68 12.6,65.74 U56.4
  Bottom Layer w0.254: M2.4 78.21,20.77 74.17,24.82 v2(74.17,68)
  Bottom Layer w0.305: U59.4 12.6,72.21 11.47,71.08 11.47,68.59 12.6,67.46 12.6,64.95
E2B: length 133.4
  Top Layer w0.254: U59.3 12.6,69.11 13.33,68.38 72.74,68.38 73.28,68.92 v2(73.28,69.01)
  Bottom Layer w0.254: v2(73.28,69.01) 73.28,24.82 75.71,22.38 M2.3
  Bottom Layer w0.305: U59.3 12.6,68.48 13.73,67.35 13.73,63.83 U56.3
ESP_RX: length 33.9
  Top Layer w0.305: U59.26 40.54,73.68 39.12,75.11 24,75.11 22.86,76.25 ESP01S1.8
  Bottom Layer w0.305: U59.26 39.41,71.73 39.41,68.72 40.54,67.59 40.54,64.95
ESP_TX: length 42.2
  Top Layer w0.305: U59.23 37.9,70.32 36.7,71.51 36.7,73.84 35.94,74.6 23.5,74.6 21.59,76.5 21.59,88.06 ESP01S1.1
  Bottom Layer w0.305: U59.23 38,68.73 39.13,67.6 39.13,63.83 U56.23
FB1: length 12.7
  Top Layer w0.254: U4.4 86.69,44.3 86.33,44.3 85.98,43.95 85.98,36.37 85.58,35.97 R6.1
  Top Layer w0.762: R7.2 R6.1
H_SCL: length 156.6
  Top Layer w0.305: R20.1 85.87,75.36 81.03,75.36 80.39,76 80.39,77.52 JY901I2C1.3 ; 78.74,78.97 78.74,59.23 77.34,57.84 55.5,57.84 51.94,54.28 51.94,36 U55.33 ; 78.74,78.97 78.81,79.05 JY901I2C1.3 ; 78.74,78.97 78.74,95.94 76.58,98.09 61.98,98.09 60.2,96.32 49.91,96.32 TOF/IIC.3 ; JY901I2C1.3 85.98,79.05 87,78.03 96.39,78.03 H20.3
  Bottom Layer w0.305: U55.33 50.7,32.86 51.83,31.73 51.83,28.27 U58.33
H_SDA: length 157.3
  Top Layer w0.305: TOF/IIC.4 52.59,98.82 76.87,98.82 79.5,96.19 79.5,82.6 80.52,81.58 JY901I2C1.4 85.85,81.58 87,80.44 96.52,80.44 H20.4 98.93,78.03 98.93,76.38 98.17,75.62 92.58,75.62 91.68,76.52 R21.1 ; v2(77.34,81.58) 77.34,59.36 76.58,58.6 55.37,58.6 50.7,53.93 U55.34
  Bottom Layer w0.305: JY901I2C1.4 v2(77.34,81.58) ; U55.34 49.57,36.17 49.57,33.41 50.7,32.28 U58.34
KEY1: length 40.8
  Top Layer w0.254: v1(8,59.87) 13.51,59.87 15.14,61.5 U56.5 ; KEY1.1 v1(3.68,40.5)
  Bottom Layer w0.254: v1(3.68,40.5) 5.08,41.9 5.08,56.95 v1(8,59.87)
  Bottom Layer w0.305: U56.5 16.27,63.83 16.27,67.47 15.14,68.6 U59.5
KEY2: length 37.8
  Top Layer w0.254: v1(7.94,61.2) 8,61.14 13.46,61.14 13.84,61.52 13.84,64.06 15.02,65.24 U56.6 ; 1.65,46.6 v1(3.43,46.6)
  Bottom Layer w0.254: v1(3.43,46.6) 3.88,46.6 4.57,47.3 4.57,57.84 v1(7.94,61.2)
  Bottom Layer w0.305: U59.6 15.14,72.72 14.01,71.59 14.01,68.72 15.14,67.59 15.14,64.95
NRST: length 8.6
  Bottom Layer w0.305: U56.41 61.99,63.83 61.99,67.15 60.86,68.28 U59.41
P_EN: length 6.3
  Top Layer w0.762: R18.1 82.32,29.5 R16.2 82.61,29.2 C32.2 82.61,26.03 R17.1
P_EN1: length 8.9
  Top Layer w0.254: R18.2 84.35,31.67 85.34,31.67 86.87,33.2 U4.5
PA0: length 121.7
  Bottom Layer w0.254: D1.1 23.26,6.64 19.94,9.96 13.46,9.96 12.45,10.97 12.45,20.88 8.13,25.2 8.13,55.3 10.8,57.96 21.59,57.96 23.75,60.12 57.4,60.12 58.32,61.04 U56.39
  Bottom Layer w0.305: U59.39 58.32,68.29 59.45,67.16 59.45,63.83 U56.39
PA1: length 122.3
  Bottom Layer w0.254: D2.1 20.72,6.77 18.03,9.45 13.21,9.45 11.94,10.72 11.94,20.62 7.62,24.94 7.62,55.42 10.67,58.47 21.08,58.47 23.11,60.5 56.51,60.5 57.15,61.14 57.15,63.68 58.32,64.85 U56.40
  Bottom Layer w0.305: U56.40 58.32,67.34 57.15,68.51 57.15,71.69 U59.40
PA3: length 8.8
  Bottom Layer w0.305: U59.38 54.65,71.73 54.65,68.84 55.78,67.72 55.78,64.95
PA4: length 56.1
  Top Layer w0.305: CN7.1 75.95,93.44 75.95,87.81 72.14,84 54.61,84 51.94,81.33 51.94,71.56 U59.33
  Bottom Layer w0.305: U56.33 51.83,63.83 51.83,67.42 50.7,68.54 U59.33
PA8: length 8.6
  Bottom Layer w0.305: U55.9 20.22,32.66 21.35,31.53 21.35,28.27 U58.9
PA9: length 30.7
  Top Layer w0.254: U58.10 21.53,28.37 23.5,28.37 24,27.86 24,25.96 25.15,24.82 31.37,24.82 UART1.2
  Bottom Layer w0.305: U55.10 19.09,36.17 19.09,33.22 20.22,32.09 U58.10
PA10: length 24.6
  Top Layer w0.254: UART1.3 29.46,24.18 24,24.18 22.61,25.58 22.61,26.99 U58.11
  Bottom Layer w0.305: U58.11 23.89,28.27 23.89,31.53 22.76,32.66 U55.11
PA11: length 115.9
  Top Layer w0.305: TOF/UART.3 48.73,93.87 47.75,92.89 20.57,92.89 13.84,86.16 13.84,83.74 5.72,75.62 5.72,59.87 7.62,57.96 v2(22.73,57.96)
  Bottom Layer w0.305: v2(22.73,57.96) 22.76,57.94 U55.12 22.76,36.77 21.63,35.64 21.63,33.22 22.76,32.09 U58.12
PA12: length 122.3
  Top Layer w0.305: TOF/UART.4 48.52,92.25 20.57,92.25 14.48,86.16 14.48,83.49 6.6,75.62 6.6,59.87 7.75,58.72 24.38,58.72 v2(25.02,58.09)
  Bottom Layer w0.305: v2(25.02,58.09) 25.02,42.98 26.63,41.37 26.63,36.46 25.3,35.13 U55.13 25.3,32.92 26.43,31.79 26.43,28.27 U58.13
PA15: length 8.6
  Bottom Layer w0.305: U55.18 30.38,36.72 29.25,35.59 29.25,33.47 30.38,32.34 U58.18
PB2: length 8.6
  Bottom Layer w0.305: U56.25 41.67,63.83 41.67,67.86 40.54,68.98 U59.25
PB3: length 8.6
  Bottom Layer w0.305: U55.30 44.49,36.17 44.49,33.41 45.62,32.28 U58.30
PB4: length 8.6
  Bottom Layer w0.305: U58.31 49.29,28.27 49.29,31.73 48.16,32.86 U55.31
PB5: length 8.6
  Bottom Layer w0.305: U58.32 48.16,32.28 47.03,33.41 47.03,36.17 U55.32
PB8: length 8.6
  Bottom Layer w0.305: U58.35 54.37,28.27 54.37,31.53 53.24,32.66 U55.35
PB9: length 8.6
  Bottom Layer w0.305: U55.36 53.24,36.8 52.11,35.67 52.11,33.22 53.24,32.09 U58.36
PB10: length 88.5
  Bottom Layer w0.254: U56.15 27.84,61.42 27.31,60.88 22.35,60.88 20.57,59.11 10.67,59.11 7.11,55.55 7.11,24.69 11.43,20.37 11.43,10.47 12.95,8.94 16,8.94 18.18,6.77 D3.1
  Bottom Layer w0.305: U56.15 28.97,63.83 28.97,67.35 27.84,68.48 U59.15
PB11: length 89
  Bottom Layer w0.254: 27.84,64.95 27.84,64.59 26.67,63.42 26.67,61.77 26.16,61.27 21.59,61.27 20.19,59.87 10.8,59.87 6.6,55.68 6.6,24.44 10.92,20.12 10.92,10.08 12.57,8.43 14.22,8.43 15.64,7.02 D4.1
  Bottom Layer w0.305: U59.16 27.84,72.33 26.71,71.2 26.71,68.46 27.84,67.33 27.84,64.95
PB14: length 79.9
  Bottom Layer w0.254: D6.1 9.91,7.09 9.91,19.74 5.59,24.05 5.59,55.93 10.92,61.27 18.29,61.27 18.91,61.89 18.91,63.67 20.22,64.97 20.22,65.33
  Bottom Layer w0.305: 20.22,65.33 20.22,67.46 19.09,68.59 19.09,71.97 19.98,72.86 U59.10
PB15: length 78.5
  Bottom Layer w0.254: U56.9 20.22,61.55 19.3,60.63 10.92,60.63 6.1,55.8 6.1,24.18 10.41,19.86 10.41,9.83 13.1,7.15 D5.1
  Bottom Layer w0.305: U56.9 21.34,63.82 21.34,64.76 21.35,64.77 21.35,67.22 20.22,68.35 U59.9
PC0: length 8.6
  Bottom Layer w0.305: U59.45 65.94,68.16 67.07,67.03 67.07,63.83 U56.45
PC1: length 9
  Bottom Layer w0.305: 65.94,64.95 65.94,67.59 64.64,68.89 64.64,71.55 65.94,72.85 U59.46
PC2: length 8.6
  Bottom Layer w0.305: U59.43 63.4,68.28 64.53,67.15 64.53,63.83 U56.43
PC3: length 8.9
  Bottom Layer w0.305: U59.44 62.23,71.69 62.23,68.88 63.4,67.71 63.4,64.95
PC8: length 8.6
  Bottom Layer w0.305: U55.7 17.68,32.66 18.81,31.53 18.81,28.27 U58.7
PC9: length 8.6
  Bottom Layer w0.305: U58.8 17.68,32.09 16.55,33.22 16.55,35.65 17.68,36.78 U55.8
PC10: length 8.6
  Bottom Layer w0.305: U58.19 34.05,28.27 34.05,31.66 32.92,32.79 U55.19
PC11: length 8.6
  Bottom Layer w0.305: U58.20 32.92,32.21 31.79,33.34 31.79,36.17 U55.20
PC12: length 8.6
  Bottom Layer w0.305: U55.21 35.46,32.79 36.59,31.66 36.59,28.27 U58.21
PC13: length 8.6
  Bottom Layer w0.305: U58.46 65.94,31.9 64.81,33.03 64.81,36.17 U55.46
PD0: length 8.6
  Bottom Layer w0.305: U58.22 35.46,32.21 34.33,33.34 34.33,35.65 35.46,36.78 U55.22
PD1: length 8.6
  Bottom Layer w0.305: U58.23 39.13,28.27 39.13,31.66 38,32.79 U55.23
PD2: length 8.6
  Bottom Layer w0.305: U55.24 36.87,36.17 36.87,33.34 38,32.21 U58.24
PD3: length 8.6
  Bottom Layer w0.305: U55.25 40.54,32.79 41.67,31.66 41.67,28.27 U58.25
PD4: length 8.6
  Bottom Layer w0.305: U58.26 40.54,32.21 39.41,33.34 39.41,36.17 U55.26
PD5: length 74.3
  Top Layer w0.254: v2(76.58,60.56) 55.42,60.56 44.32,49.45 44.32,36 U55.27
  Bottom Layer w0.254: H26.2 88.9,60.38 87.88,61.39 82.17,61.39 81.39,60.62 81.39,60.56 v2(76.58,60.56)
  Bottom Layer w0.305: U55.27 43.08,32.79 44.21,31.66 44.21,28.27 U58.27
PD6: length 8.6
  Bottom Layer w0.305: U55.28 41.95,36.17 41.95,33.34 43.08,32.21 U58.28
PD7: length 74.5
  Top Layer w0.254: U55.29 46.86,36 46.86,50.76 55.66,59.55 v2(76.01,59.55)
  Bottom Layer w0.254: H26.1 89.79,58.22 77.34,58.22 v2(76.01,59.55)
  Bottom Layer w0.305: U58.29 46.75,28.27 46.75,31.73 45.62,32.86 U55.29
PD14: length 8.6
  Bottom Layer w0.305: U58.3 12.6,27.64 13.73,28.77 13.73,31.53 12.6,32.66 U55.3
PE0: length 8.6
  Bottom Layer w0.305: U58.37 56.91,28.27 56.91,31.53 55.78,32.66 U55.37
PE1: length 8.6
  Bottom Layer w0.305: U58.38 55.78,32.09 54.65,33.22 54.65,35.52 55.78,36.65 U55.38
PE4: length 8.6
  Bottom Layer w0.305: U58.43 64.53,28.27 64.53,31.35 63.4,32.48 U55.43
PE5: length 8.6
  Bottom Layer w0.305: U55.44 62.27,36.17 62.27,33.03 63.4,31.9 U58.44
PE6: length 8.6
  Bottom Layer w0.305: U58.45 67.07,28.27 67.07,31.35 65.94,32.48 U55.45
PE9: length 76.4
  Top Layer w0.254: U56.24 38,65.1 36.7,63.81 36.7,59.87 41.78,54.79 v2(41.78,22.35)
  Bottom Layer w0.254: v2(41.78,22.35) 46.34,22.35 47.03,21.66 47.03,21.66 47.5,21.19 47.5,8.31 46.81,7.62 U41.10
  Bottom Layer w0.305: 38,64.95 38,67.59 36.87,68.72 36.87,71.73 U59.24
PE10: length 8.6
  Bottom Layer w0.305: U56.21 36.59,63.83 36.59,67.35 35.46,68.48 U59.21
PE11: length 89.5
  Top Layer w0.254: v2(39.5,23.55) 39.44,23.61 39.44,38.09 40,38.66 40,54.77 34.16,60.61 34.16,63.68 35.46,64.97 U56.22
  Bottom Layer w0.254: U41.5 49.33,12.7 48.26,13.77 48.26,22.39 47.11,23.55 v2(39.5,23.55)
  Bottom Layer w0.305: 35.46,64.95 35.46,67.33 34.33,68.46 34.33,71.42 35.23,72.32 35.31,72.32 35.46,72.47 U59.22
PE12: length 8.6
  Bottom Layer w0.305: U56.19 34.05,63.83 34.05,67.35 32.92,68.48 U59.19
PE13: length 80.6
  Top Layer w0.254: U56.20 31.62,63.94 31.62,61.39 39.5,53.52 39.5,39.29 38.74,38.53 37.34,38.53 36.7,37.9 36.7,24.18 v2(39.24,21.64)
  Bottom Layer w0.254: U41.11 45.94,9.09 46.3,9.09 46.68,9.47 46.68,20.43 45.47,21.64 v2(39.24,21.64)
  Bottom Layer w0.305: U59.20 31.79,71.73 31.79,68.46 32.92,67.33 32.92,64.95
PE14: length 95.2
  Top Layer w0.254: v2(34.16,24.44) 34.16,38.15 34.93,38.91 38.1,38.91 38.99,39.8 38.99,52.76 30.38,61.36 U56.17
  Bottom Layer w0.254: v2(34.16,24.44) 51.35,24.44 61.89,13.89 66.17,13.89 66.93,13.13 66.93,11.46 U41.4
  Bottom Layer w0.305: U56.17 31.51,63.83 31.51,67.47 30.38,68.6 U59.17
PE15: length 8.8
  Bottom Layer w0.305: U59.18 30.38,72.59 29.25,71.47 29.25,68.46 30.38,67.33 30.38,64.95
SWDCLK: length 8.6
  Bottom Layer w0.305: U55.17 30.38,32.92 31.51,31.79 31.51,28.27 U58.17
SWDIO: length 8.6
  Bottom Layer w0.305: U55.14 24.17,36.17 24.17,33.47 25.3,32.34 U58.14
$1N1656: length 17.7
  Top Layer w0.508: 92.33,47.8 94.23,45.9 94.23,40.82 93.91,40.5 C9.2 92.24,40.5 U4.8
  Top Layer w0.762: U51.2 91.6,47.07 92.33,47.8
$1N1657: length 3.5
  Top Layer w0.508: C9.1 90.68,44.06 U4.1
$1N1908: length 2.3
  Top Layer w0.406: PWR.2 80.81,53.3 R24.1
$1N4369: length 2.7
  Top Layer w0.254: R23.2 26.01,15.28 Q3.1
$1N4372: length 4.9
  Top Layer w0.305: Q3.2 24.48,13.53 BUZZER1.2
$1N7155: length 4.1
  Top Layer w0.406: Q4.1 27.04,49.27 R90.1
$1N7448: length 26.4
  Top Layer w0.406: 5VS1.1 1.65,55.17 1.65,50.09 3.3,48.44 17.51,48.44 U52.2 Q4.3
$1N7843: length 4
  Top Layer w0.406: Q5.1 27.1,53.08 R92.1
$1N7851: length 25.6
  Top Layer w0.406: 5VS2.1 2.79,64.06 4.06,62.79 4.06,59.61 7.75,55.93 17.39,55.93 U54.2 Q5.3

## Copper pours and planes (outline as drawn; the poured copper is in the pictures)
GND on Top Layer: -48.13,130.35 112.27,130.35 112.27,-13.66 -48.13,-13.66
GND on Bottom Layer: -10.41,107.37 132.46,107.37 132.46,-26.87 -10.41,-26.87
PGND on Top Layer: 64.77,24.94 99.57,24.94 99.57,1.7 64.77,1.7
VCC on Top Layer: 82.8,40.18 92.96,40.18 92.96,18.21 82.8,18.21
VIN_SW on Top Layer: 83.31,16.81 97.16,16.81 97.16,9.19 83.31,9.19

Small or netless copper shapes (teardrops, artwork), in the pictures only: 279 on Top Layer, 281 on Bottom Layer

## Text on the board
Top Silkscreen Layer: DIN1 | GND | 3V3 | DIN2 | VCC | H | L | 5V | SCL | A11 | SDA | A12 | A0 | CLK | A4 | RX | TX | R | T | G | AG | A6 | A5 | A3 | A2 | A1 | UART7 | D5 | D7 | ON | OFF | + | - | ZZY
